# Altium schematic sheet PSU.SchDoc
size A3; SheetNumber: 2; SheetTotal: 5
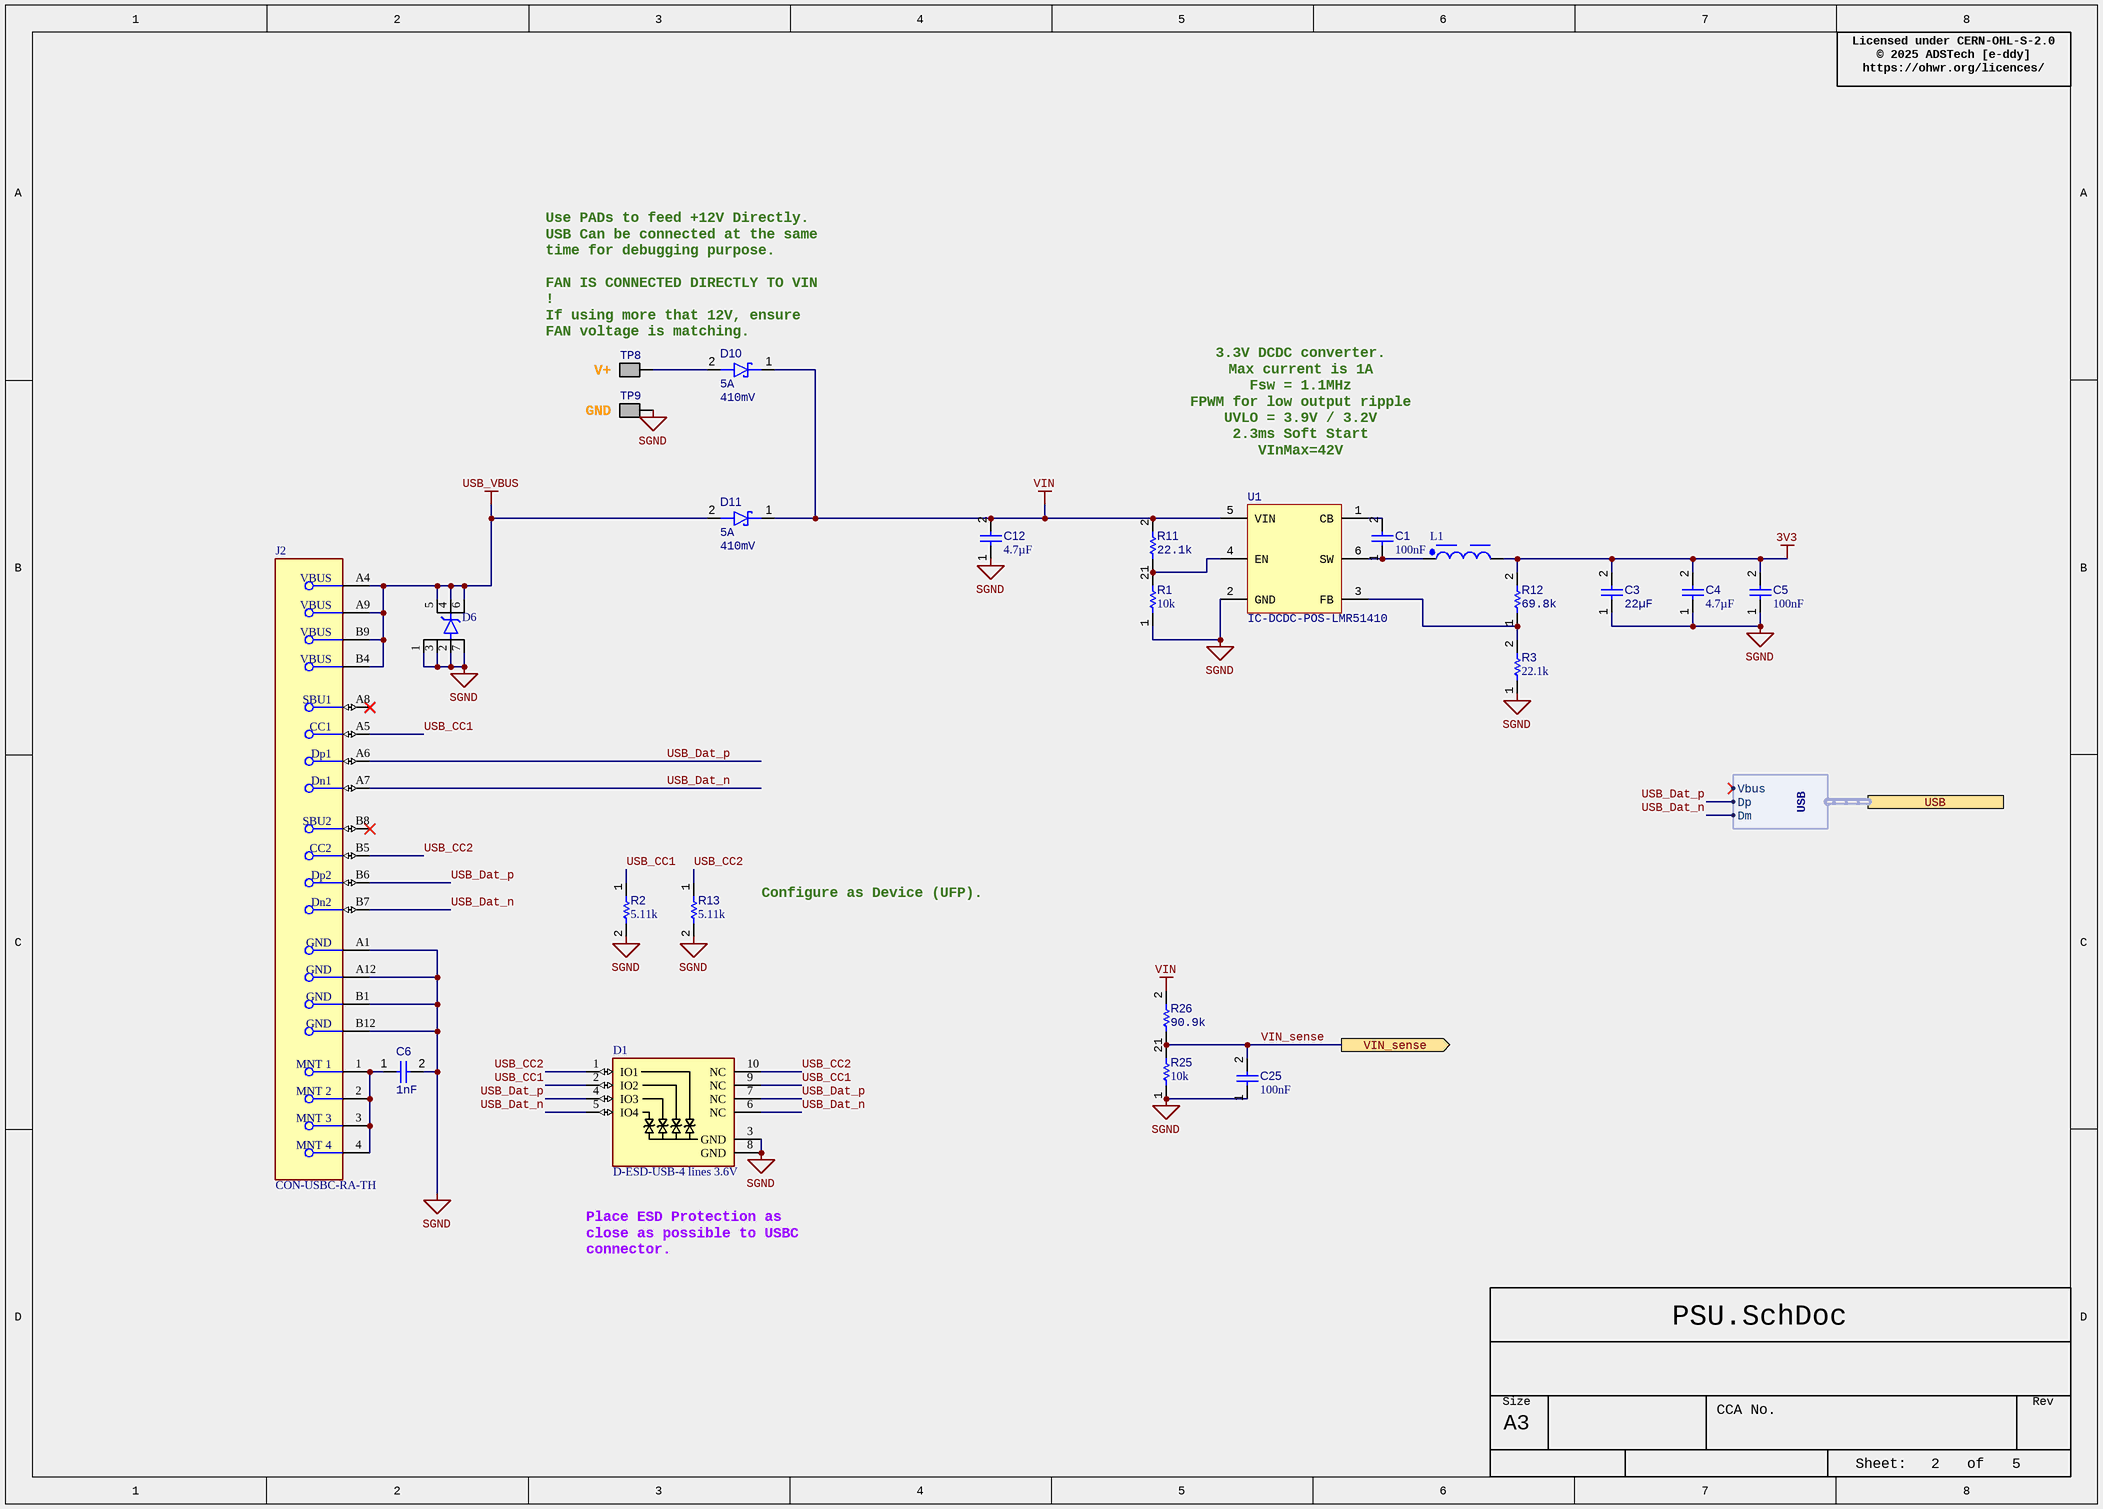
[diagram p0: PSU.SchDoc]

## Parts
C1  value 100nF  [CAP_0402-IPC_B]  (hidden comment: C-0402-CER-X7R-100nF-10%-50V)
C3  value 22µF  [FP-GRM21B-0_2-e0_2_0_7-MFG]  (hidden comment: C-0805-CER-X5R-22µF-25V)
C4  value 4.7µF  [FP-C2012X7R1H475K125AC-IPC_B]  (hidden comment: C-0805-CER-X7R-4,7µF-10%-50V)
C5  value 100nF  [CAP_0402-IPC_B]  (hidden comment: C-0402-CER-X7R-100nF-10%-50V)
C6  value 1nF  [CAP-1206-IPC_B]  (hidden comment: C-1206-CER-X7R-1nF-10%-1kV)
C12  value 4.7µF  [FP-C2012X7R1H475K125AC-IPC_B]  (hidden comment: C-0805-CER-X7R-4,7µF-10%-50V)
C25  value 100nF  [CAP_0402-IPC_B]  (hidden comment: C-0402-CER-X7R-100nF-10%-50V)
D1  D-ESD-USB-4 lines 3.6V  [FP-DQA0010A-MFG]
D6  D-TVS-14V-TVS1400DRVR  [FP-DRV0006A-MFG]  (value not drawn)
D10  Forward Current: 5A  Forward Voltage: 410mV  [FP-S8-V-3915_01-001-CATHO-MFG]  (hidden comment: D-SCH-VSSAF5N50-DO-221AD-2-5A-50V)
D11  Forward Current: 5A  Forward Voltage: 410mV  [FP-S8-V-3915_01-001-CATHO-MFG]  (hidden comment: D-SCH-VSSAF5N50-DO-221AD-2-5A-50V)
J2  CON-USBC-RA-TH  [FP-USB4085-GF-A-MFG]
L1  L-2424-22uH-2.1A-74404064220  [WE-LQS_6045]  (value not drawn)
R1  value 10k  [RES-0402-IPC_B]  (hidden comment: R-0402-10000.0-1%-100ppm-0.5)
R2  value 5.11k  [RES-0402-IPC_B]  (hidden comment: R-0402-5110.0-1%-100ppm-0.5)
R3  value 22.1k  [RES-0402-IPC_B]  (hidden comment: R-0402-22100.0-1%-100ppm-0.5)
R11  value 22.1k  [RES-0402-IPC_B]  (hidden comment: R-0402-22100.0-1%-100ppm-0.5)
R12  value 69.8k  [RES-0402-IPC_B]  (hidden comment: R-0402-69800.0-0.1%-25ppm-0.016)
R13  value 5.11k  [RES-0402-IPC_B]  (hidden comment: R-0402-5110.0-1%-100ppm-0.5)
R25  value 10k  [RES-0402-IPC_B]  (hidden comment: R-0402-10000.0-1%-100ppm-0.5)
R26  value 90.9k  [RES-0402-IPC_B]  (hidden comment: R-0402-90900.0-1%-100ppm-0.5)
TP8  Name: V+  [3x2 pad]  (hidden comment: SMT-PAD-3x2)  (no BOM)
TP9  Name: GND  [3x2 pad]  (hidden comment: SMT-PAD-3x2)  (no BOM)
U1  IC-DCDC-POS-LMR51410  [ETA-SOT23-6_N]

## Ports
USB (harness USB, see Block diagram[6B], MCU[6A]), VIN_sense (out, see Block diagram[6B], MCU[2C])

## Harnesses
USB: Vbus, Dm, Dp

## Nets
3V3: C3.2 C4.2 C5.2 L1.2 R12.2
SGND: C3.1 C4.1 C5.1 C6.2 C12.1 C25.1 D1.3(GND) D1.8(GND) D6.1(GND) D6.2(GND) D6.3(GND) D6.7(GND) J2.A1(GND) J2.A12(GND) J2.B1(GND) J2.B12(GND) R1.1 R2.2 R3.1 R13.2 R25.1 TP9.1 U1.2(GND)
USB_VBUS: D6.4(IN) D6.5(IN) D6.6(IN) D11.2(A) J2.A4(VBUS) J2.A9(VBUS) J2.B4(VBUS) J2.B9(VBUS)
VIN: C12.2 D10.1(K) D11.1(K) R11.2 R26.2 U1.5(VIN)
USB_CC1: D1.2(IO2) D1.9(NC) J2.A5(CC1) R2.1
USB_CC2: D1.1(IO1) D1.10(NC) J2.B5(CC2) R13.1
USB_Dat_n: D1.5(IO4) D1.6(NC) J2.A7(Dn1) J2.B7(Dn2) ; port USB.Dm
USB_Dat_p: D1.4(IO3) D1.7(NC) J2.A6(Dp1) J2.B6(Dp2) ; port USB.Dp
VIN_sense: C25.2 R25.2 R26.1 ; port VIN_sense
NetC1_1: C1.1 L1.1 U1.6(SW)
NetC1_2: C1.2 U1.1(CB)
NetC6_1: C6.1 J2.1(MNT_1) J2.2(MNT_2) J2.3(MNT_3) J2.4(MNT_4)
NetD10_2: D10.2(A) TP8.1
NetR1_2: R1.2 R11.1 U1.4(EN)
NetR3_2: R3.2 R12.1 U1.3(FB)

Not connected (* = marked no-connect by the designer): J2 A8(SBU1)* B8(SBU2)*

## Notes on the sheet
- Licensed under CERN-OHL-S-2.0
  © 2025 ADSTech [e-ddy]
  https://ohwr.org/licences/
- Use PADs to feed +12V Directly. USB Can be connected at the same time for debugging purpose.
  FAN IS CONNECTED DIRECTLY TO VIN !
  If using more that 12V, ensure FAN voltage is matching.
- 3.3V DCDC converter.
  Max current is 1A
  Fsw = 1.1MHz
  FPWM for low output ripple
  UVLO = 3.9V / 3.2V
  2.3ms Soft Start
  VInMax=42V
- Configure as Device (UFP).
- Place ESD Protection as close as possible to USBC connector.
- Size
- A3
- CCA No.
- Sheet:
- of
- Rev

## Library data of the parts
C1 C5 C25 = CMP-001-00003-5: Multilayer Ceramic Capacitor, 0.1 uF, 50 V, ± 10%, X7R, 0402 [1005 Metric]; Voltage Rating: 50V; Package Quantity: 50000; Pins: 2; Case Code (Imperial): 0402; RoHS Compliant: Yes; Voltage Rating (DC): 50V; Series: GRM; Max Operating Temperature: 125°C; Dielectric: X7R; Length: 0.039inch; Packaging: Tape and Reel; Thickness: 0.022inch; Material: Ceramic; Mounting Technology: Surface Mount; Tolerance: 10%; Lead Free: Lead Free; Case Code (Metric): 1005; Case/Package: 0402; Width: 0.02inch; Termination: SMD/SMT; Weight: 0.000212oz; Min Operating Temperature: -55°C; Height: 0.5mm
C3 = CMP-001-00016-1: Ceramic Capacitor, Multilayer, Ceramic, 25V, 20% +Tol, 20% -Tol, X5R, 15% TC, 22uF, Surface Mount, 0805; Multilayer: Yes; Pins: 2; Termination: Wraparound; Tolerance (fill in as +-): 20%; Width: 1.25mm; JESD-609 Code: e3; Dielectric Material: Ceramic; Max Operating Temperature: 85°C; Min Operating Temperature: -55°C; Rated DC Voltage (URdc): 25V; Reach SVHC Compliant: Yes; Terminal Finish: Nickel; Packaging: Tape and Reel; Height: 1.25mm; Length: 2mm; RoHS Compliant: Yes; Package Style: SMTMeter; Case/Package: 0805; Capacitor Type: Ceramic; Package Shape: Rectangular; Tolerance  (fill in as +-): 20%; Mounting Technology: Surface Mount; Temperature Characteristics Code: X5R
C4 C12 = CMP-001-00011-4: Ceramic Capacitor, Multilayer, Ceramic, 50V, 10% +Tol, 10% -Tol, X7R, 15% TC, 4.7uF, Surface Mount, 0805; Case/Package: 0805; Pins: 2; Capacitor Type: Ceramic; RoHS Compliant: Yes
C6 = CMP-001-00041-1: Ceramic Capacitor, Multilayer, Ceramic, 1000V, 10% +Tol, 10% -Tol, X7R, 15% TC, 0.001uF, Surface Mount, 1206; Rated DC Voltage (URdc): 1kV; Multilayer: Yes; Reference Standard: AEC-Q200; Dielectric Material: Ceramic; Tolerance  (fill in as +-): 10%; Height: 1.25mm; Capacitor Type: Ceramic; Mounting Technology: Surface Mount; Termination: Wraparound; Max Operating Temperature: 125°C; Packaging: Tape and Reel; Length: 3.2mm; Reach SVHC Compliant: Yes; Package Style: SMTMeter; RoHS Compliant: Yes; Temperature Characteristics Code: X7R; Width: 1.6mm; Min Operating Temperature: -55°C; Tolerance (fill in as +-): 10%; Case/Package: 1206; Package Shape: Rectangular; Pins: 2
D1 = CMP-004-00014-1: Trans Voltage Suppressor Diode, 17W, 3.6V V(RWM), Bidirectional, 4 Element, Silicon; Reference Standard: IEC-61000-4-2; Terminal Finish: Nickel; Moisture Sensitivity Level: 1; JESD-609 Code: e4; Reach SVHC Compliant: Yes; Diode Type: TRANS VOLTAGE SUPPRESSOR; RoHS Compliant: Yes
D6 = CMP-004-00013-2: Trans Voltage Suppressor Diode, 14V V(RWM), Unidirectional, Silicon; Telecom IC Type: SURGE PROTECTION CIRCUIT; JESD-609 Code: e4; RoHS Compliant: Yes; Terminal Finish: Nickel; Reach SVHC Compliant: Yes; Moisture Sensitivity Level: 2
D10 D11 = CMP-004-00001-2: Rectifier Diode, Schottky, 1 Phase, 1 Element, 5A, 50V V(RRM), Silicon, DO-221AC; Number of Phases: 1; Non-rep Pk Forward Current-Max: 100A; Max Reverse Current: 1.4mA; Application(s): EFFICIENCY; Package Body Material: Plastic; JEDEC-95 Code: DO-221AC; Terminal Position: DUAL; Terminal Form: Flat; JESD-609 Code: e3; Technology: SCHOTTKY; Diode Element Material: SILICON; Max Operating Temperature: 150°C; Surface Mount: Yes; Terminal Finish: Tin; Max Output current: 5A; Package Shape: Rectangular; Pins: 2; Package Style: SMALL OUTLINEMeter; Rep Pk Reverse Voltage-Max: 50V; RoHS Compliant: Yes; Diode Type: RECTIFIER; Case/Package: DO-221AC; Number of Elements: 1; JESD-30 Code: R-PDSO-F2; Min Operating Temperature: -40°C; Reach SVHC Compliant: Yes
J2 = CMP-002-00038-1: USB Connector, 16 Contact(s), Female, Right Angle, Solder Terminal, Receptacle
L1 = CMP-006-00011-1: General Purpose Inductor, 22uH, 20%, 1 Element, SMD, 2424; Self Resonant Frequency: 10MHz; Max Current Rating: 2.1A; Test Frequency: 100kHz; Inductor Application: POWER INDUCTOR; Shape/Size Description: RECTANGULAR PACKAGE; DC Resistance (DCR): 89mR; Channels: 1; Shielding: Unshielded; Case/Size Code: 2424; Reach SVHC Compliant: Yes; Surface Mount: Yes; Max Operating Temperature: 125°C; Terminal Placement: Dual Ended; Pins: 2; Case/Package: 2424; Tolerance: 20%; Current Rating: 2.1A; Min Operating Temperature: -40°C; Inductance-Nom (L): 22uH; RoHS Compliant: Yes; Termination: One Surface; Inductor Type: GENERAL PURPOSE INDUCTOR
R1 R25 = RES-0402-00288-6: 0402 10000.0 Ω 1% 100ppm 0.063W Resistor; MPN: RC0402FR-0710KL; Power: 63mW; TCR: 100ppm; Package: 0402; Tolerance: 1%
R2 R13 = RES-0402-00260-5: 0402 5110.0 Ω 1% 100ppm 0.063W Resistor; MPN: CRCW04025K11FKED; Power: 63mW; Tolerance: 1%; TCR: 100ppm; Package: 0402
R3 R11 = RES-0402-00321-5: 0402 22100.0 Ω 1% 100ppm 0.063W Resistor; MPN: CRCW040222K1FKED; Power: 63mW; TCR: 100ppm; Tolerance: 1%; Package: 0402
R12 = RES-0402-00658-3: 0402 69800.0 Ω 0.1% 25ppm 0.016W Resistor; Power: 16mW; Tolerance: 0.1; TCR: 25; Package: 0402
R26 = RES-0402-00380-5: 0402 90900.0 Ω 1% 100ppm 0.063W Resistor; MPN: CRCW040290K9FKED; Power: 63mW; TCR: 100ppm; Package: 0402; Tolerance: 1%
TP8 TP9 = CMP-00096-1: 3x2mm standard pad for wire soldering
U1 = CMP-019-00024-1: SIMPLE SWITCHER® 4V to 42V, 1A synchronous buck converter with 26.5uA IQ 6-SOT-23 -40 to 150